# EAGLE design pj14 (EAGLE 7.4.0)
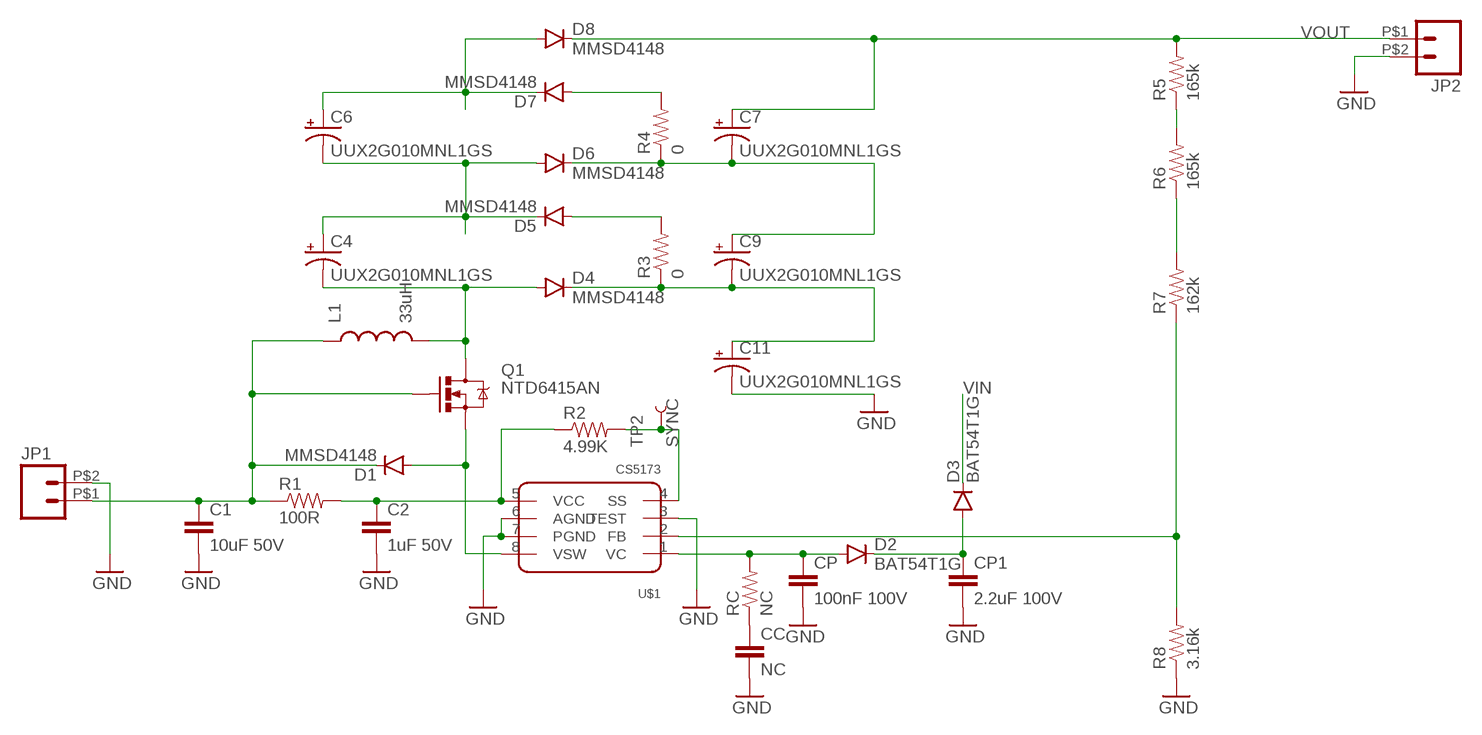
[diagram p0: schematic, sheet 1]

## Parts
C1  10uF 50V  10UF50V20%(1210)  [1210]
C2  1uF 50V  10UF50V20%(1210)  [1210]
C4  UUX2G010MNL1GS  CAP_POLE  [PANASONIC_E]
C6  UUX2G010MNL1GS  CAP_POLE  [PANASONIC_E]
C7  UUX2G010MNL1GS  CAP_POLE  [PANASONIC_E]
C9  UUX2G010MNL1GS  CAP_POLE  [PANASONIC_E]
C11  UUX2G010MNL1GS  CAP_POLE  [PANASONIC_E]
CC  NC  1.2PF-50V-20%(0603)  [0603-CAP]
CP  100nF 100V  1.2PF-50V-20%(0603)  [0603-CAP]
CP1  2.2uF 100V  10UF50V20%(1210)  [1210]
D1  MMSD4148  DIODESOD123  [SOD-123]
D2  BAT54T1G  DIODESOD123  [SOD-123]
D3  BAT54T1G  DIODESOD123  [SOD-123]
D4  MMSD4148  DIODESOD123  [SOD-123]
D5  MMSD4148  DIODESOD123  [SOD-123]
D6  MMSD4148  DIODESOD123  [SOD-123]
D7  MMSD4148  DIODESOD123  [SOD-123]
D8  MMSD4148  DIODESOD123  [SOD-123]
JP1  M02  [1X02_5.08]
JP2  M02  [1X02_5.08]
L1  33uH  INDUCTORPWR  [CDRH125]
Q1  NTD6415AN  MOSFET-NCHANNELFDD8780  [DPAK]
R1  100R  2.0KOHM1/10W5%(0603)  [0603-RES]
R2  4.99K  2.0KOHM1/10W5%(0603)  [0603-RES]
R3  0  2.0KOHM1/10W5%(0603)  [0603-RES]
R4  0  2.0KOHM1/10W5%(0603)  [0603-RES]
R5  165k  2.0KOHM1/10W5%(0603)  [0603-RES]
R6  165k  2.0KOHM1/10W5%(0603)  [0603-RES]
R7  162k  2.0KOHM1/10W5%(0603)  [0603-RES]
R8  3.16k  2.0KOHM1/10W5%(0603)  [0603-RES]
RC  NC  2.0KOHM1/10W5%(0603)  [0603-RES]
TP2  SYNC  TEST-POINT3  [PAD.03X.03]
U$1  CS5173  [SOIC−8]

## Nets
GND: C1.2 C2.2 C11.- CC.2 CP1.2 CP.2 JP1.P$2 JP2.P$2 R8.1 U$1.3(TEST) U$1.6(AGND) U$1.7(PGND)
N$1: CC.1 RC.1
N$2: C2.1 R1.2 R2.1 U$1.5(VCC)
N$3: D1.A Q1.3(S) U$1.8(VSW)
N$4: C4.- D4.A L1.2 Q1.4(D)
N$5: R2.2 TP2.P$1 U$1.4(SS)
N$6: CP.1 D2.A RC.2 U$1.1(VC)
N$7: R7.1 R8.2 U$1.2(FB)
N$8: CP1.1 D2.C D3.A
N$10: D5.A R3.2
N$11: C9.- C11.+ D4.C R3.1
N$12: C4.+ C6.- D5.C D6.A
N$13: C6.+ D7.C D8.A
N$14: D7.A R4.2
N$19: C7.- C9.+ D6.C R4.1
N$21: R5.1 R6.2
N$22: R6.1 R7.2
VIN: C1.1 D1.C D3.C JP1.P$1 L1.1 Q1.1(G) R1.1
VOUT: C7.+ D8.C JP2.P$1 R5.2

## Library data of the parts
C1 C2 CP1 = SparkFun-Capacitors:10UF50V20%(1210): CAP-09824; PROD_ID: CAP-09824; VALUE: 10uF
C4 C6 C7 C9 C11 = SparkFun-Capacitors:CAP_POL: Capacitor Polarized These are standard SMD and PTH capacitors. Normally 10uF, 47uF, and 100uF in electrolytic and tantalum varieties. Always verify the external diameter of the through hole cap, it varies with capacity, voltage, and manufacturer. The EIA devices should be standard.
CC CP = SparkFun-Capacitors:1.2PF-50V-20%(0603): CAP-09201; PROD_ID: CAP-09201; VALUE: 1.2pF
D1-D8 = SparkFun-DiscreteSemi:DIODE: Diode These are standard reverse protection diodes and small signal diodes. SMA package can handle up to about 1A. SOD-323 can handle about 200mA. What the SOD-323 package when ordering, there are some mfgs out there that are 5-pin packages.
JP1 JP2 = SparkFun-Connectors:M02: Standard 2-pin 0.1" header. Use with - straight break away headers ( PRT-00116) - right angle break away headers (PRT-00553) - swiss pins (PRT-00743) - machine pins (PRT-00117) - female headers (PRT-00115) Molex polarized connector foot print use with: PRT-08233 with associated crimp pins and housings. 2.54_SCREWTERM for use with PRT-10571. 3.5mm Screw Terminal footprints for PRT-08084 5mm Screw Terminal footprints for use with PRT-08432
L1 = SparkFun-Passives:INDUCTOR: Inductors Basic Inductor/Choke - 0603 and 1206. Footprints are not proven and vary greatly between part numbers. INDUCTOR POWER 3.3UH 4.0A SMD 0.197" L x 0.197" W x 0.177" H (5.00mm x 5.00mm x 4.50mm)
Q1 = SparkFun-DiscreteSemi:MOSFET-NCHANNEL: Common NMOSFET Parts MFG P/N Store ID Prod ID FDD8780 TRANS-09984 SI7820DN TRANS-11055 FDS6630A IC-08089 2N7002PW TRANS-11151 FQP30N06L COM-10213 TRANS-10060 BSS123LT1G TRANS-08345 BSS138 TRANS-00830 BS170 2N7000; PROD_ID: TRANS-09984
R1-R8 RC = SparkFun-Resistors:2.0KOHM1/10W5%(0603): RES-08296; PROD_ID: RES-08296; VALUE: 2.0k
TP2 = SparkFun-Passives:TEST-POINT: Bare copper test points for troubleshooting or ICT
U$1 = r1:CS5173

## Board
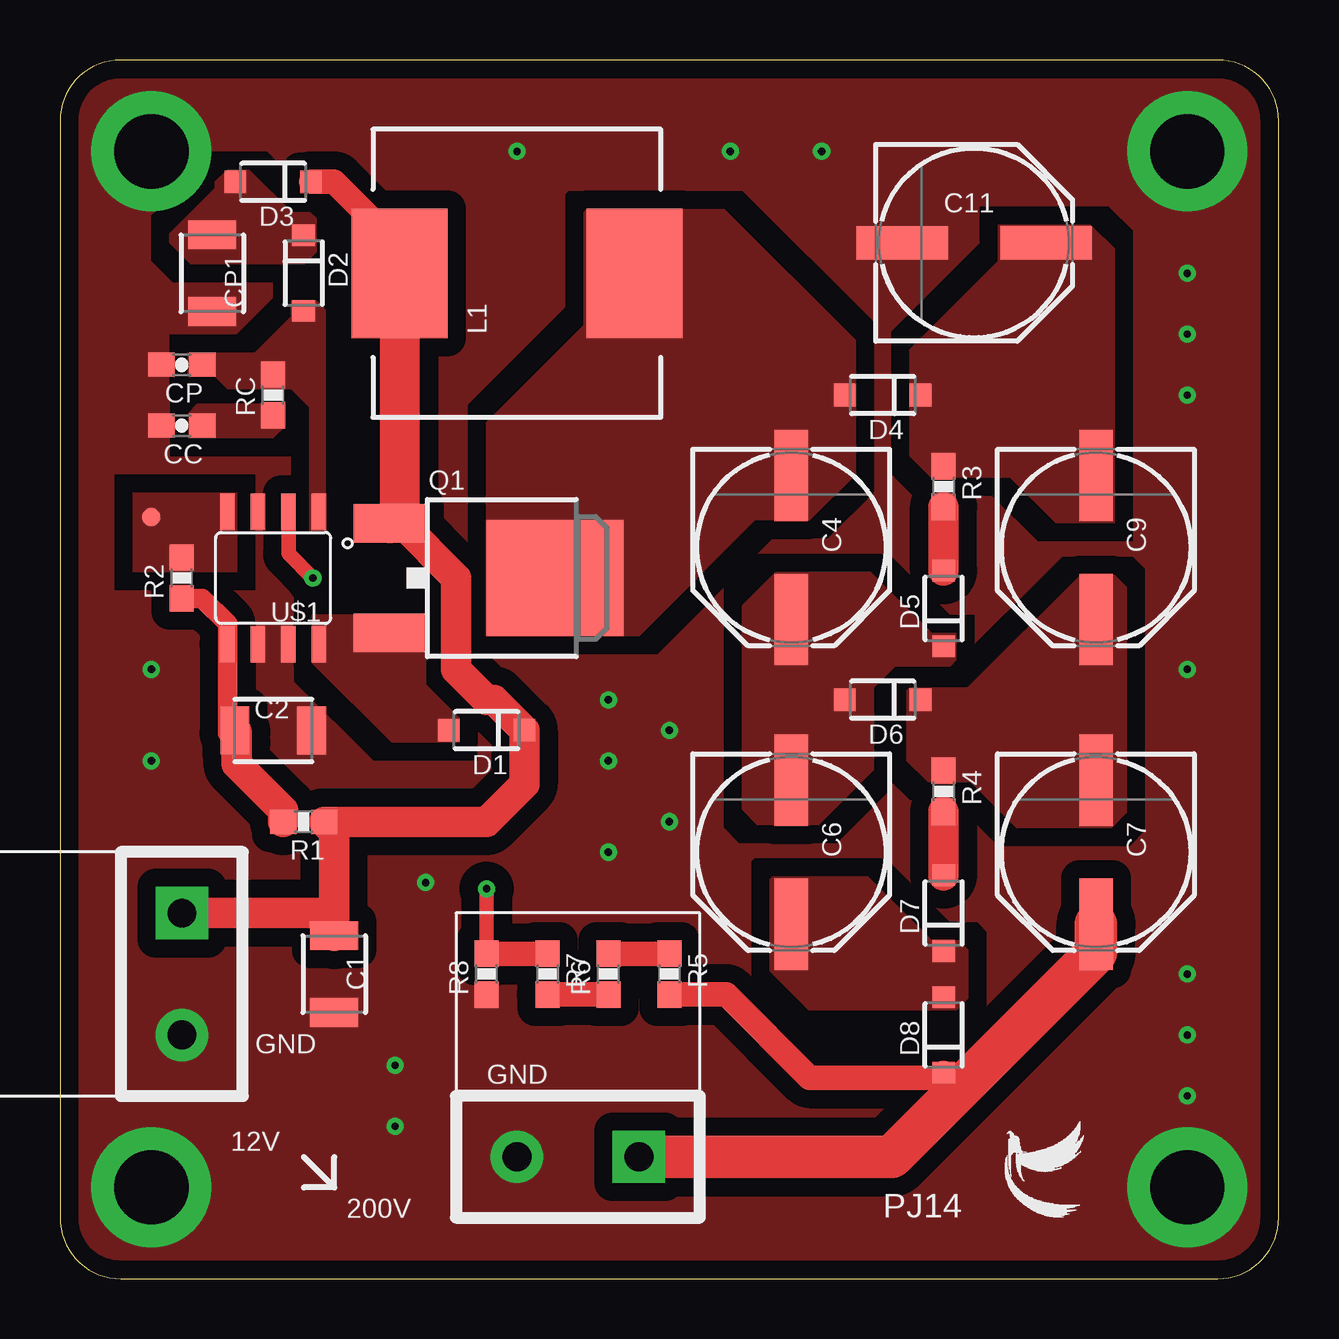
[diagram p1: board, top side]
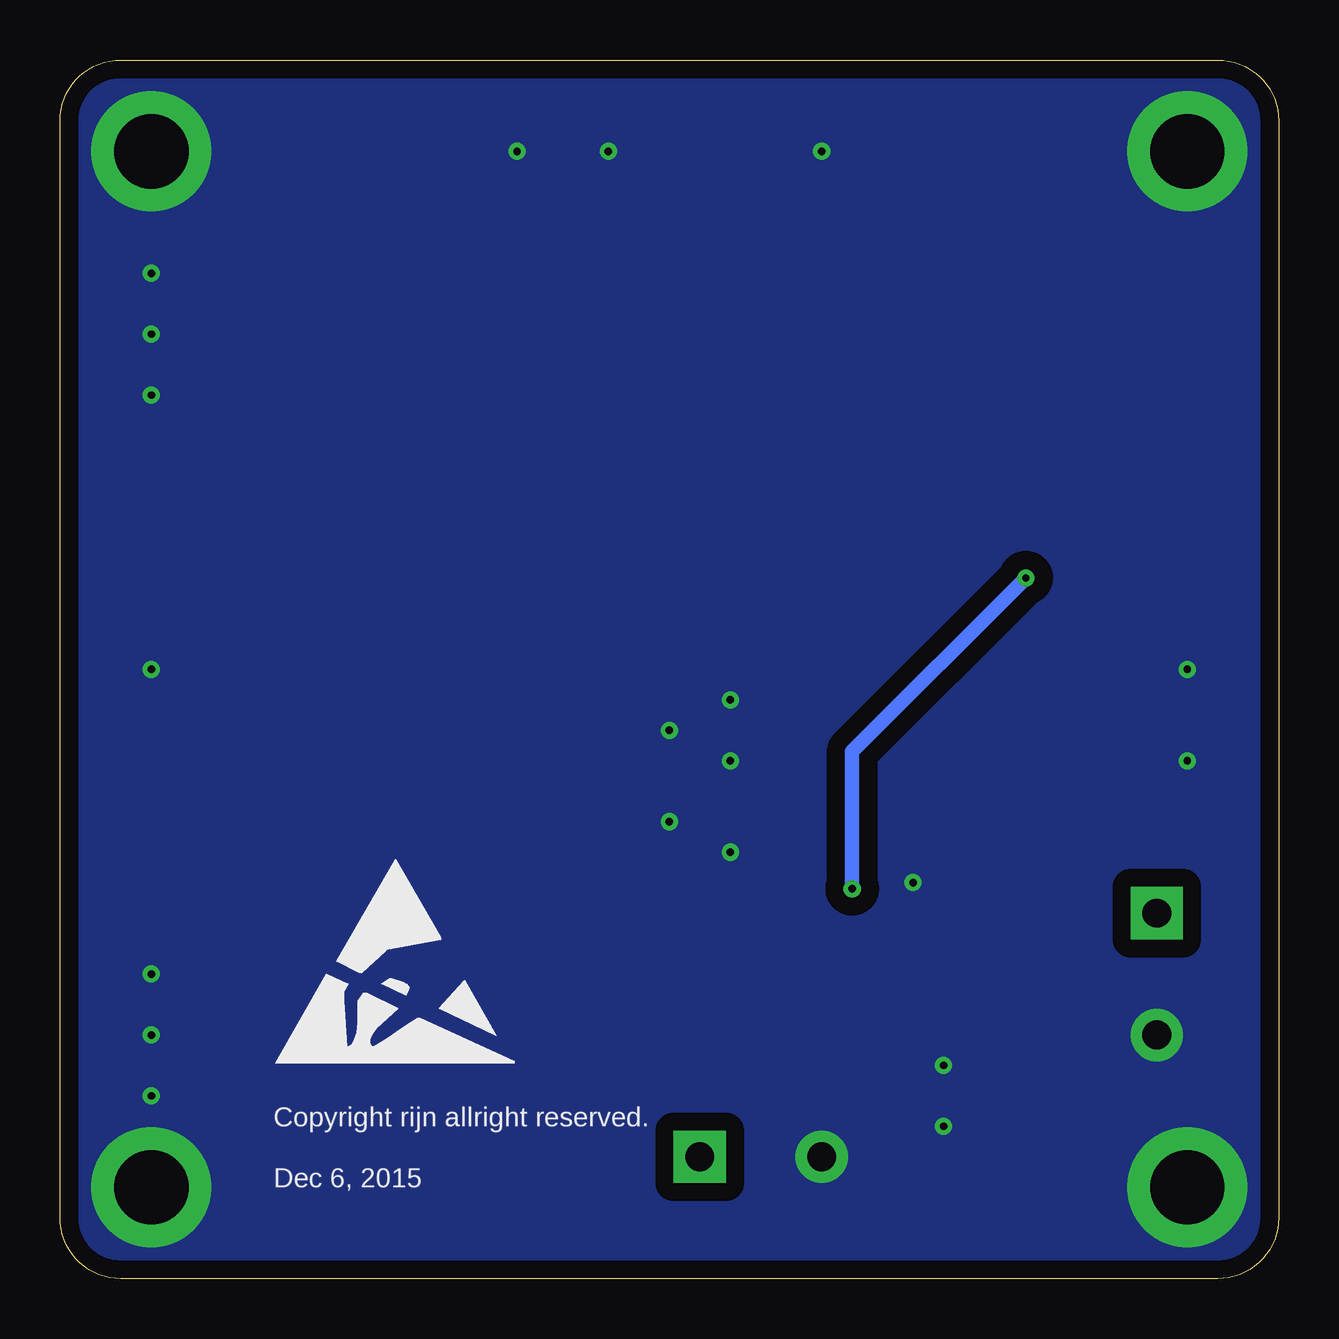
[diagram p2: board, bottom side, seen from below]

Size 50.8 x 50.8 mm. Coordinates in mm from the lower left corner, seen from the top.
Outline: 0,48.26 0,2.54 arc90 2.54,0 48.26,0 arc90 50.8,2.54 50.8,48.26 arc90 48.26,50.8 2.54,50.8 arc90 0,48.26
Copper layers (1*16): Top 0.035mm / dielectric 1.5mm / Bottom 0.035mm
Design rules "default *": minimum track width 8mil, minimum drill 12mil, track to track 15mil, track to pad 15mil, pad to pad 15mil, via to via 15mil, smd to smd 8mil, copper to edge 5mil, drill to drill 8mil, minimum pad ring 10mil, minimum via ring 8mil, stop-mask expansion 4mil, vias tented up to drill 15mil, thermal gap 10mil

### Footprints (pad centres in the part's own frame; a part is rotated, then mirrored left to right if it is on the bottom)
1210 = smd 1.2 x 2: 1 -1.6,0; 2 1.6,0
PANASONIC_E = smd 3.8 x 1.4: + 3,0; - -3,0
0603-CAP = smd 1.1 x 1: 1 -0.85,0; 2 0.85,0
SOD-123 = smd 0.9 x 0.95: A 1.575,0; C -1.575,0
1X02_5.08 = drill 1.2 pad 2.184 square: P$1 -2.54,0 | drill 1.2 pad 2.184: P$2 2.54,0
CDRH125 = smd 5.4 x 4: 1 0,4.9; 2 0,-4.9
DPAK = smd 1.6 x 3: 1 -2.28,-5.31; 3 2.28,-5.31 | smd 4.826 x 5.715: 4 0,1.588
0603-RES = smd 1.1 x 1: 1 -0.85,0; 2 0.85,0
PAD.03X.03 = smd 0.762 x 0.762: P$1 0,0
SOIC−8 = smd 0.6 x 1.52: 1 -1.905,-2.76; 2 -0.635,-2.76; 3 0.635,-2.76; 4 1.905,-2.76; 5 1.905,2.76; 6 0.635,2.76; 7 -0.635,2.76; 8 -1.905,2.76

### Placement (x,y rotation side)
C1  11.43,12.7 270 top
C2  8.89,22.86 0 top
C4  30.48,30.48 270 top
C6  30.48,17.78 270 top
C7  43.18,17.78 270 top
C9  43.18,30.48 270 top
C11  38.1,43.18 0 top
CC  5.08,35.56 180 top
CP  5.08,38.1 180 top
CP1  6.35,41.91 270 top
D1  17.78,22.86 180 top
D2  10.16,41.91 270 top
D3  8.89,45.72 180 top
D4  34.29,36.83 180 top
D5  36.83,27.94 90 top
D6  34.29,24.13 180 top
D7  36.83,15.24 90 top
D8  36.83,10.16 90 top
JP1  5.08,12.7 270 top
JP2  21.59,5.08 180 top
L1  19.05,41.91 90 top
Q1  19.05,29.21 270 top
R1  10.16,19.05 180 top
R2  5.08,29.21 90 top
R3  36.83,33.02 270 top
R4  36.83,20.32 270 top
R5  25.4,12.7 270 top
R6  22.86,12.7 90 top
R7  20.32,12.7 270 top
R8  17.78,12.7 90 top
RC  8.89,36.83 90 top
TP2  3.81,31.75 0 top
U$1  8.89,29.21 180 top
U$2  [LOGO]  39.37,2.54 0 top
U$3  [ESD_10.00]  41.91,8.89 0 bottom

### Tracks (layer width: path | path; a pad name or v marks a point on that pad's centre or on a via)
GND  (via drill 0.3, 3.1 pad 5)
  other vias: 3.81,46.99 46.99,46.99 46.99,3.81 3.81,3.81 31.75,46.99 27.94,46.99 19.05,46.99 3.81,25.4 3.81,21.59 46.99,41.91 46.99,39.37 46.99,36.83 46.99,25.4 46.99,12.7 46.99,10.16 46.99,7.62 13.97,6.35 13.97,8.89 15.24,16.51 22.86,17.78 22.86,21.59 22.86,24.13 25.4,22.86 25.4,19.05
  pour Top (isolate 0.762, rank 6, no thermals): -1.27,52.07 57.15,52.07 57.15,-1.27 -1.27,-1.27
  pour Bottom (isolate 0.762, rank 6, no thermals): -3.81,54.61 54.61,54.61 54.61,-3.81 -3.81,-3.81
N$1
  pour Top (no thermals): 5.33,36.07 5.33,35.05 8.89,35.05 9.4,35.56 9.4,36.45 5.71,36.45
N$2
  Top 0.813: 7.37,22.35 6.98,22.73 U$1.5 6.98,27.3 5.93,28.36 R2.1
  Top 1.27: R1.2 9.31,19.52 7.37,21.46 7.37,22.35 7.37,22.78 C2.1
N$3
  pour Top (no thermals): 10.54,27.18 10.54,27.69 15.24,27.69 15.24,24.77 16.64,23.37 16.64,22.35 13.84,22.35 10.54,25.65
N$4
  pour Top (no thermals): 21.97,44.58 27.69,44.58 33.15,39.12 33.15,33.53 31.24,31.62 28.96,31.62 24.13,26.8 17.78,26.8 17.78,35.69 21.84,39.75 21.84,44.45
N$5
  pour Top (no thermals): 3.05,32.77 7.37,32.77 7.37,29.46 3.05,29.46
N$6
  pour Top (no thermals): 9.65,40.77 10.67,40.77 11.05,40.39 11.05,31.11 10.41,31.11 10.41,36.32 9.65,37.08 6.98,37.08 6.48,37.59 5.33,37.59 5.33,38.61 6.48,38.61 8.13,38.61 9.65,40.13
N$7  (via drill 0.3)
  Top 0.61: U$1.2 9.53,30.23 v10.54,29.21 | v17.78,16.26 R8.2
  Top 1.016: R8.2 R7.1
  Bottom 0.61: v10.54,29.21 17.78,21.97 v17.78,16.26
N$8
  pour Top (no thermals): 6.98,46.23 7.87,46.23 9.65,44.45 10.41,44.45 10.67,44.2 10.67,42.8 10.16,42.29 5.46,42.29 4.57,43.18 4.57,43.56 6.48,45.47 6.48,45.72
N$10
  Top 1.27: D5.A R3.2
N$11
  pour Top (no thermals): 39.12,43.94 42.93,43.94 43.94,42.93 43.94,31.5 41.53,31.5 39.62,33.4 36.32,33.4 35.43,34.29 35.43,38.74 39.12,42.42
N$12
  pour Top (no thermals): 29.84,29.46 33.78,29.46 36.32,26.92 37.34,26.92 37.34,25.78 37.08,25.53 34.8,25.53 33.91,24.64 33.91,21.21 31.62,18.92 29.08,18.92 28.45,19.56 28.45,28.07
N$13
  pour Top (no thermals): 29.72,16.76 33.66,16.76 36.32,14.1 37.47,14.1 37.85,13.72 37.85,11.68 37.34,11.18 31.24,11.18 29.59,12.83 29.59,16.64
N$14
  Top 1.27: R4.2 D7.A
N$19
  pour Top (no thermals): 35.43,24.64 37.85,24.64 42.55,29.34 43.94,29.34 44.45,28.83 44.45,19.43 43.82,18.8 39.88,18.8 37.97,20.7 36.2,20.7 35.31,21.59 35.31,24.51
N$21
  Top 1.016: R6.2 R5.1
N$22
  Top 1.016: R7.2 R6.1
VIN
  Top 1.016: D3.C 11.43,45.72 13.97,43.18 13.97,42.09 L1.1
  Top 1.27: Q1.1 14.23,31.49 16.51,29.21 16.51,25.4 17.78,24.13 18.09,24.13 D1.C 19.36,20.62 17.78,19.05 R1.1 11.43,18.63 11.43,15.24 | C1.1 11.43,15.24 | JP1.P$1 11.43,15.24
  Top 1.676: L1.1 14.15,31.9 Q1.1
VOUT
  Top 1.016: R5.2 27.77,11.85 31.24,8.38 36.63,8.38 | 36.63,8.38 D8.C | 36.63,8.38 36.96,8.38 37.47,7.87
  Top 1.778: JP2.P$1 34.67,5.08 37.47,7.87 43.18,13.59 C7.+

### Text on the board
tNames: GND | GND | 12V | 200V | PJ14
bNames: Copyright rijn allright reserved. | Dec 6, 2015